# Altium schematic sheet ACS712电流检测.SchDoc
size A4
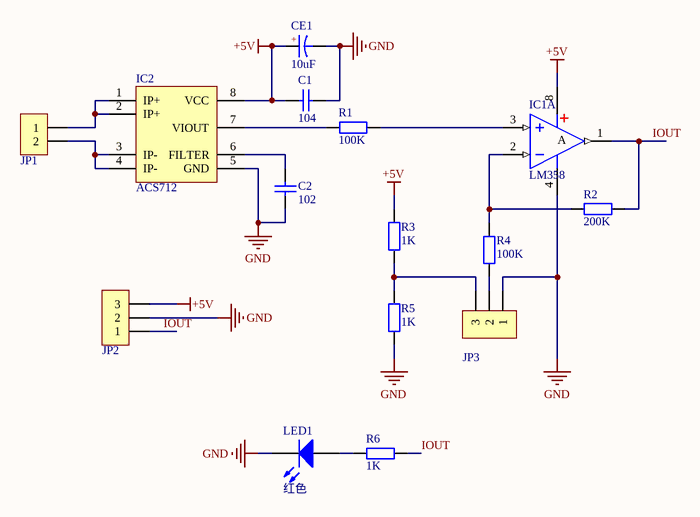
[diagram p0: ACS712电流检测.SchDoc]

## Parts
C1  104  [CC 2.2*5]
C2  102  [CC 1.8*3.6]
CE1  10uF  [CAP 2.5*5*11 - BK]
IC1  LM358  [DIP8-300_MH]  (part A of 2)
IC2  ACS712  [SOP8_M]
JP1  HDR-1X2  [KF7620-2P]  (value not drawn)
JP2  HDR-1X3  [KF128-3.81-3P]  (value not drawn)
JP3  HDR-1X3  [HDR2.54-LI-3P]  (value not drawn)
LED1  红色  [LED 3MM-B]
R1  100K  [RS 1/4W]
R2  200K  [RS 1/4W]
R3  1K  [RS 1/4W]
R4  100K  [RS 1/4W]
R5  1K  [RS 1/4W]
R6  1K  [RS 1/4W]

## Nets
+5V: C1.1 CE1.1 IC1.8(V+) IC2.8(VCC) JP2.3 R3.2
GND: C1.2 C2.1 CE1.2 IC1.4(V-) IC2.5(GND) JP2.2 JP3.1 LED1.2(K) R5.1
IOUT: IC1.1(OUT) JP2.1 R2.2 R6.1
NetC2_2: C2.2 IC2.6(FILTER)
NetIC1_2: IC1.2(IN-) R2.1 R4.2
NetIC1_3: IC1.3(IN+) R1.2
NetIC2_1: IC2.1(IP+) IC2.2(IP+) JP1.1
NetIC2_3: IC2.3(IP-) IC2.4(IP-) JP1.2
NetIC2_7: IC2.7(VIOUT) R1.1
NetJP3_2: JP3.2 R4.1
NetJP3_3: JP3.3 R3.1 R5.2
NetLED1_1: LED1.1(A) R6.2

## Notes on the sheet
- (in symbol CE) +
- (in symbol LM358, part A) A

## Library data of the parts
C1 C2 = CC: 瓷片电容; BOM名称: 直插瓷片电容; 联系卖家，免费查找封装: 唯一出售店铺网址https://shop463601444.taobao.com; 封装库来自淘宝卖家ID：黄晶宝石: 其他店铺购入均为盗版假冒封装库，请立即申请退款
CE1 = CE: 直插电解电容; 联系卖家，免费查找封装: 唯一出售店铺网址https://shop463601444.taobao.com; 封装库来自淘宝卖家ID：黄晶宝石: 其他店铺购入均为盗版假冒封装库，请立即申请退款; BOM名称: 直插电解电容
IC1 = LM358: 双路运放; 联系卖家，免费查找封装: 唯一出售店铺网址https://shop463601444.taobao.com; BOM名称: 双路运放
IC2 = ACS712: 电流检测芯片; 联系卖家，免费查找封装: 唯一出售店铺网址https://shop463601444.taobao.com; BOM名称: 电流检测芯片
JP1 = Header 2: 2P接插件; 联系卖家，免费查找封装: 唯一出售店铺网址https://shop463601444.taobao.com; BOM名称: 2P接插件
JP2 = Header 3: 3P接插件; 联系卖家，免费技术支持: 唯一出售店铺网址https://shop463601444.taobao.com; BOM名称: 3P接插件
JP3 = Header 3: 3P接插件; 封装库来自淘宝卖家 ID：黄晶宝石: 其他店铺购入均为盗版假冒封装库; 联系卖家，免费查找封装: 唯一出售店铺网址https://shop463601444.taobao.com; BOM名称: 3P接插件
LED1 = LED-3MM: 直插3mm LED; BOM名称: 插件LED; 封装库来自淘宝卖家 ID：黄晶宝石: 其他店铺购入均为假冒，请立即申请退款，本店奖励现金5~20元
R1-R6 = R-S: 色环电阻; 联系卖家，免费查找封装: 唯一出售店铺网址https://shop463601444.taobao.com; 封装库来自淘宝卖家ID：黄晶宝石: 其他店铺购入均为盗版假冒封装库，请立即申请退款; BOM名称: 色环电阻